# EAGLE schematic fall_detection (EAGLE 9.6.2)
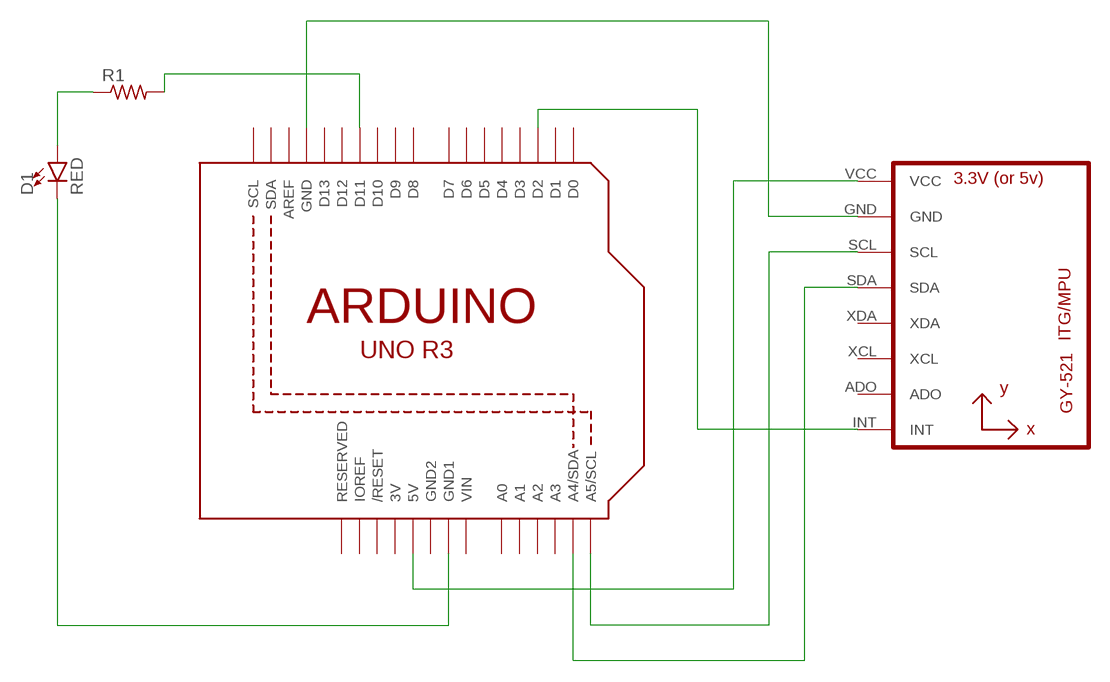
[diagram p0: schematic, sheet 1]

## Parts
D1  RED  LED-RED0603  [LED-0603]
R1  R-US_0204/2V  [0204V]
U1  GY-521MPU6050  [GY-521]
U2  ARDUINOR3-DIMENSION  [ARDUINOR3]

## Nets
N$1: U1.INT U2.D2
N$2: U1.VCC U2.5V
N$3: U1.GND U2.GND
N$4: U1.SCL U2.A5(A5/SCL)
N$5: U1.SDA U2.A4(A4/SDA)
N$6: R1.2 U2.D11
N$7: D1.A R1.1
N$8: D1.C U2.GND1
Unconnected: U1.ADO U1.XCL U1.XDA U2.A0 U2.A1 U2.A2 U2.A3 U2.AREF U2.D0 U2.D1 U2.D3 U2.D4 U2.D5 U2.D6 U2.D7 U2.D8 U2.D9 U2.D10 U2.D12 U2.D13 U2.IOREF U2.RESERVED U2.RESET(/RESET) U2.SCL U2.SDA

## Power pins joined to a net without a drawn wire
3V: U2.3V
GND2: U2.GND2
VIN: U2.VIN

## Library data of the parts
D1 = SparkFun-LED:LED-RED: Red SMD LED Used in manufacturing of most products at SparkFun Packages: 0603 - SMD 0603 package [Product Link] <http://docs.avagotech.com/docs/AV02-0551EN> 0603 SMART - SMD 0603 SMART package ( more efficient and expensive)[Product Link] <http://www.osram-os.com/Graphics/XPic2/00077099_0.pdf> 1206 - SMD1206 package [Product Link] <https://www.sparkfun.com/datasheets/DevTools/LilyPad/Q150OVS4.pdff> SparkFun Products: Pro Mini 328 -5V <https://www.sparkfun.com/products/821> RedBoard <https://www.sparkfun.com/products/12757> IOIO-OTG <https://www.sparkfun.com/products/13613>; PROD_ID: DIO-00819
R1 = adafruit:R-US_: RESISTOR, American symbol
U1 = gy-521:GY-521
U2 = adafruit:ARDUINOR3: This is a new object for the new Arduino R3 - with extra pins that you may want to use (such as IOref, and duplicated A4/A5